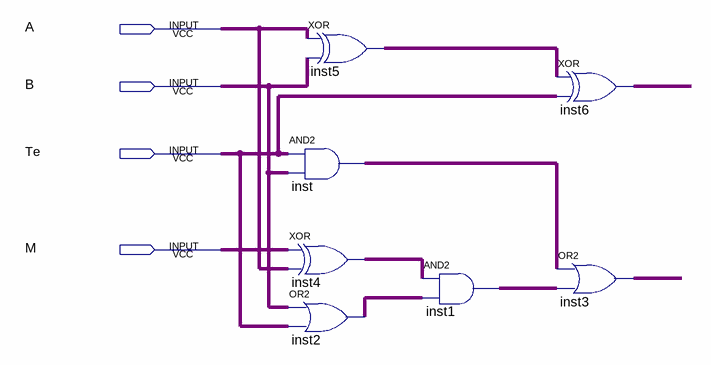
[diagram p0: schematic sheet]
// Quartus schematic Somador_Subtrator.bdf as structural Verilog: 7 symbols, 4 pins
module Somador_Subtrator (
  input  A,
  input  B,
  input  Te,
  input  M
);

  wire inst1_out, inst2_out, inst3_out, inst4_out, inst5_out, inst6_out, inst_out;

  xor inst5 (inst5_out, A, B);
  and inst (inst_out, Te, B);
  xor inst4 (inst4_out, M, A);
  or inst2 (inst2_out, B, Te);
  and inst1 (inst1_out, inst4_out, inst2_out);
  xor inst6 (inst6_out, inst5_out, Te);
  or inst3 (inst3_out, inst_out, inst1_out);
endmodule
